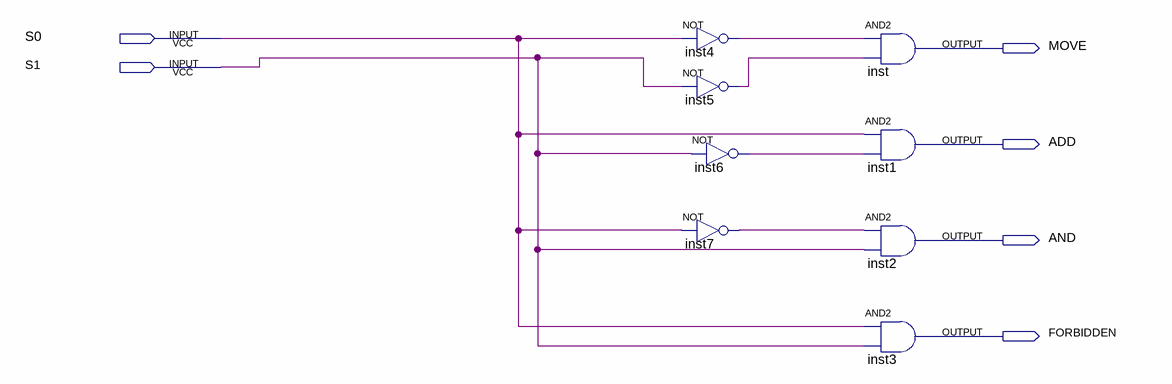
[diagram p0: schematic sheet]
// Quartus schematic COMMAND.bdf as structural Verilog: 8 symbols, 6 pins
module COMMAND (
  input  S0,
  input  S1,
  output MOVE,
  output ADD,
  output AND,
  output FORBIDDEN
);

  wire inst4_out, inst5_out, inst6_out, inst7_out;

  not inst4 (inst4_out, S0);
  not inst5 (inst5_out, S1);
  not inst6 (inst6_out, S1);
  not inst7 (inst7_out, S0);
  and inst (MOVE, inst4_out, inst5_out);
  and inst1 (ADD, S0, inst6_out);
  and inst2 (AND, inst7_out, S1);
  and inst3 (FORBIDDEN, S0, S1);
endmodule
